# Altium schematic sheet MainBoard.SchDoc
size A4
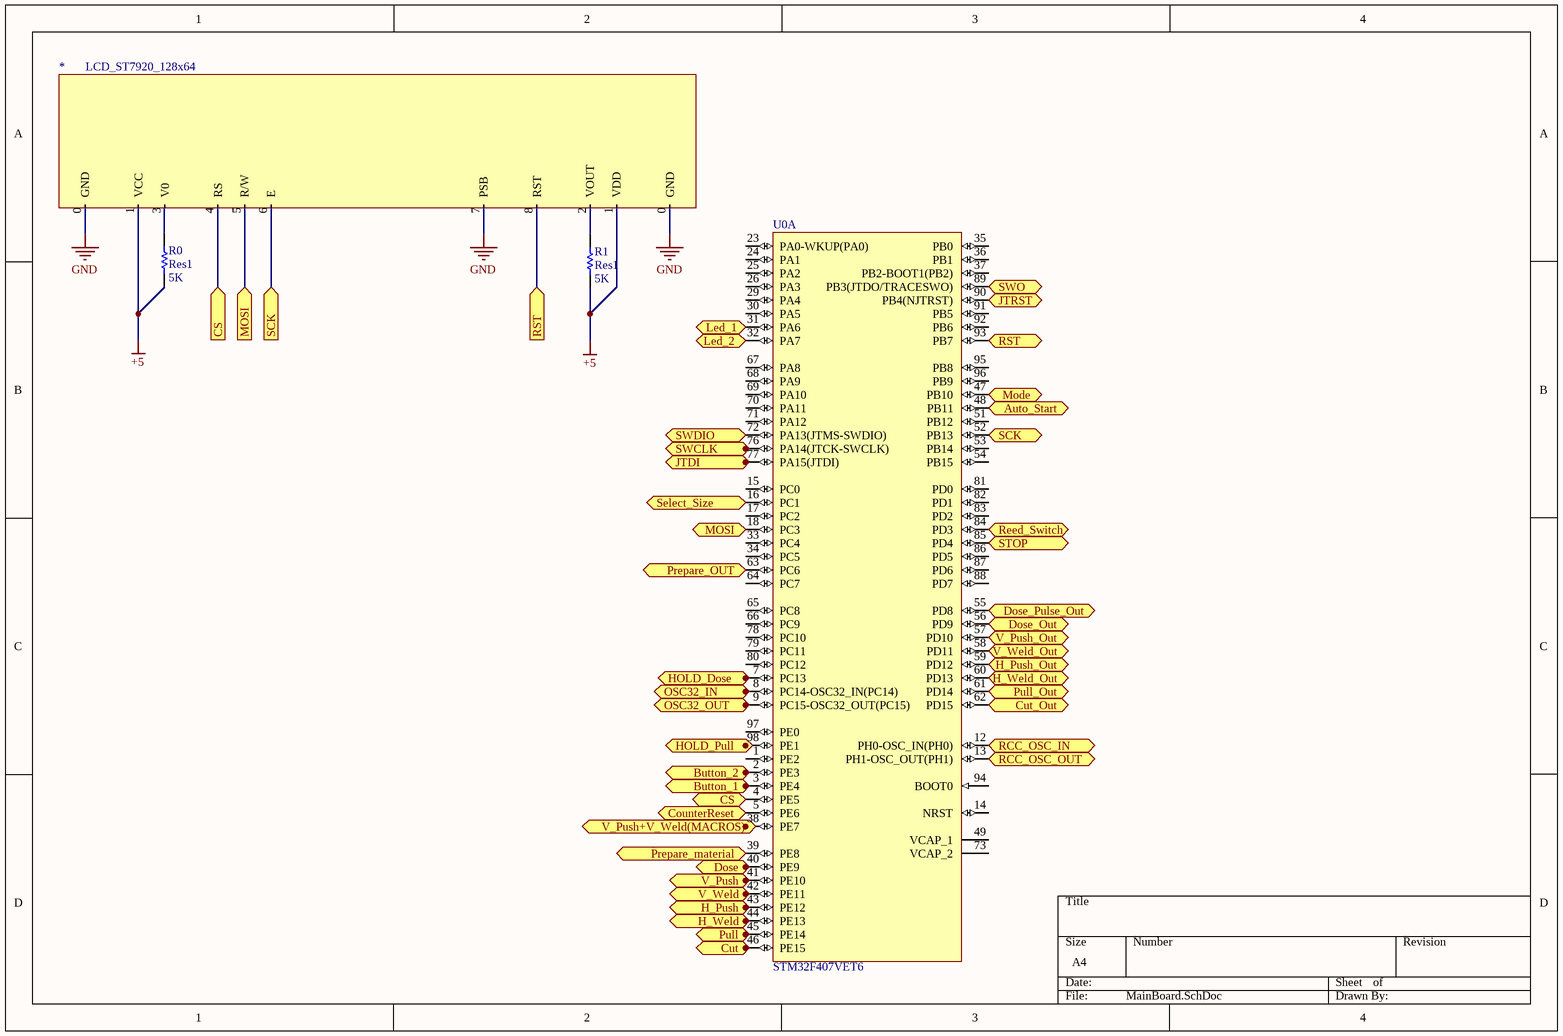
[diagram p0: MainBoard.SchDoc]

## Parts
*  LCD_ST7920_128x64
R0  Res1  value 5K  [AXIAL-0.3]
R1  Res1  value 5K  [AXIAL-0.3]
U0  STM32F407VET6  [STM-LQFP100_N]  (part A of 2)

## Ports
Auto_Start (in), Button_1 (in), Button_2 (in), CounterReset (in), CS (in), CS (out), Cut (in), Cut_Out (out), Dose (in), Dose_Out (out), Dose_Pulse_Out (out), H_Push (in), H_Push_Out (out), H_Weld (in), H_Weld_Out (out), HOLD_Dose (in), HOLD_Pull (in), JTDI (in), JTRST (in), Led_1 (out), Led_2 (out), Mode (in), MOSI (in), MOSI (out), OSC32_IN (in), OSC32_OUT (out), Prepare_material (in), Prepare_OUT (out), Pull (in), Pull_Out (out), RCC_OSC_IN (in), RCC_OSC_OUT (out), Reed_Switch (in), RST (in), RST (out), SCK (in), SCK (out), Select_Size (in), STOP (in), SWCLK (bidir), SWDIO (bidir), SWO (out), V_Push (in), V_Push+V_Weld(MACROS) (in), V_Push_Out (out), V_Weld (in), V_Weld_Out (out)

## Nets
+5: *.1(VCC) R0.1 R1.1
GND: *.0(GND) *.7(PSB)
Auto_Start: U0.48(PB11) ; port Auto_Start
CounterReset: U0.5(PE6) ; port CounterReset
CS: *.4(RS) U0.4(PE5) ; port CS
Cut_Out: U0.62(PD15) ; port Cut_Out
Dose_Out: U0.56(PD9) ; port Dose_Out
Dose_Pulse_Out: U0.55(PD8) ; port Dose_Pulse_Out
H_Push_Out: U0.59(PD12) ; port H_Push_Out
H_Weld_Out: U0.60(PD13) ; port H_Weld_Out
JTRST: U0.90(PB4(NJTRST)) ; port JTRST
Led_1: U0.31(PA6) ; port Led_1
Led_2: U0.32(PA7) ; port Led_2
Mode: U0.47(PB10) ; port Mode
MOSI: *.5(R/W) U0.18(PC3) ; port MOSI
Prepare_material: U0.39(PE8) ; port Prepare_material
Prepare_OUT: U0.63(PC6) ; port Prepare_OUT
Pull_Out: U0.61(PD14) ; port Pull_Out
RCC_OSC_IN: U0.12(PH0-OSC_IN(PH0)) ; port RCC_OSC_IN
RCC_OSC_OUT: U0.13(PH1-OSC_OUT(PH1)) ; port RCC_OSC_OUT
Reed_Switch: U0.84(PD3) ; port Reed_Switch
RST: *.8(RST) U0.93(PB7) ; port RST
SCK: *.6(E) U0.52(PB13) ; port SCK
Select_Size: U0.16(PC1) ; port Select_Size
STOP: U0.85(PD4) ; port STOP
SWDIO: U0.72(PA13(JTMS-SWDIO)) ; port SWDIO
SWO: U0.89(PB3(JTDO/TRACESWO)) ; port SWO
V_Push_Out: U0.57(PD10) ; port V_Push_Out
V_Weld_Out: U0.58(PD11) ; port V_Weld_Out
Net*_2: *.2(VOUT) R1.2
Net*_3: *.3(V0) R0.2

Not connected (* = marked no-connect by the designer): U0 1(PE2) 2(PE3) 3(PE4) 7(PC13) 8(PC14-OSC32_IN(PC14)) 9(PC15-OSC32_OUT(PC15)) 14(NRST) 15(PC0) 17(PC2) 23(PA0-WKUP(PA0)) 24(PA1) 25(PA2) 26(PA3) 29(PA4) 30(PA5) 33(PC4) 34(PC5) 35(PB0) 36(PB1) 37(PB2-BOOT1(PB2)) 38(PE7) 40(PE9) 41(PE10) 42(PE11) 43(PE12) 44(PE13) 45(PE14) 46(PE15) 49(VCAP_1) 51(PB12) 53(PB14) 54(PB15) 64(PC7) 65(PC8) 66(PC9) 67(PA8) 68(PA9) 69(PA10) 70(PA11) 71(PA12) 73(VCAP_2) 76(PA14(JTCK-SWCLK)) 77(PA15(JTDI)) 78(PC10) 79(PC11) 80(PC12) 81(PD0) 82(PD1) 83(PD2) 86(PD5) 87(PD6) 88(PD7) 91(PB5) 92(PB6) 94(BOOT0) 95(PB8) 96(PB9) 97(PE0) 98(PE1)

## Library data of the parts
R0 R1 = Res1: Resistor; Published: 8-Jun-2000; LatestRevisionDate: 17-Jul-2002; LatestRevisionNote: Re-released for DXP Platform.; PackageReference: AXIAL-0.3; Publisher: Altium Limited; PackageDescription: Axial Device, Thru-Hole; 2 Leads; 0.3 in Pin Spacing
U0 = STM32F407VET6: ARM Cortex-M4 32-bit MCU+FPU, 210 DMIPS, 512 kB Flash, 192 kB Internal RAM, 82 I/Os, 100-pin LQFP, -40 to 85 degC, Tray; Manufacturer: STMicroelectronics; D/A Converter: 2x12-bit; FLASH Size (Prog) (kB): 512; I/Os (High Current): 82; Internal RAM Size (kB): 192; Operating Frequency(F) (Processor speed) (MHz): 168; Supply Voltage(Vcc) max (V): 3.6; Supply Voltage(Vcc) min (V): 1.8; DatasheetVersion: Rev. 4; PackageVersion: Rev. 1, 06/2013; PackageReference: LQFP100; PackageDescription: 100-Pin Low Profile Quad Flat Package, 14 x 14 mm Body, 0.5 mm Pitch; Supplier 1: Digi-Key; Supplier Part Number 1: 497-12075-ND; Supplier 2: Farnell; Supplier Part Number 2: 2064367; Supplier 3: Newark; Supplier Part Number 3: 73T2332; Supplier 4: Mouser; Supplier Part Number 4: 511-STM32F407VET6; Core: ARM Cortex-M4; Packing: Tray; Mounting Technology: Surface Mount; PartNumber: STM32F407VET6; ComponentLink1Description: Manufacturer URL; ComponentLink1URL: http://www.st.com/web/en/home.html; ComponentLink2Description: Datasheet; ComponentLink2URL: http://www.st.com/st-web-ui/static/active/en/resource/technical/document/datasheet/DM00037051.pdf; ComponentLink3Description: Package Specification; ComponentLink3URL: http://www.st.com/st-web-ui/static/active/en/resource/technical/document/data_brief/DM00071938.pdf